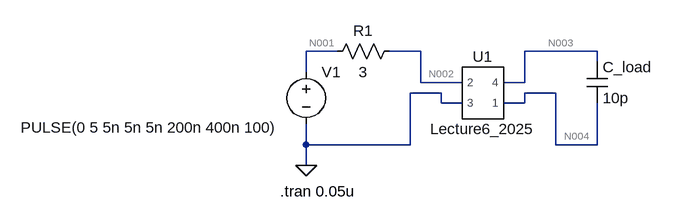
[diagram p0: schematic 08_LTspiceTemplate_SGW2_2024.asc]
08_LTspiceTemplate_SGW2_2024.asc, the LTspice schematic file:
Version 4.1
SHEET 1 880 680
WIRE 0 128 -48 128
WIRE 128 128 80 128
WIRE 400 128 288 128
WIRE 400 144 400 128
WIRE -48 160 -48 128
WIRE 128 176 128 128
WIRE 192 176 128 176
WIRE 288 176 288 128
WIRE 288 176 256 176
WIRE 160 192 112 192
WIRE 336 192 288 192
WIRE 160 208 160 192
WIRE 192 208 160 208
WIRE 288 208 288 192
WIRE 288 208 256 208
WIRE -48 272 -48 240
WIRE 112 272 112 192
WIRE 112 272 -48 272
WIRE 336 272 336 192
WIRE 400 272 400 208
WIRE 400 272 336 272
WIRE -48 304 -48 272
FLAG -48 304 0
SYMBOL voltage -48 144 R0
WINDOW 3 -439 101 Left 2
WINDOW 123 0 0 Left 0
WINDOW 39 0 0 Left 0
SYMATTR Value PULSE(0 5 5n 5n 5n 200n 400n 100)
SYMATTR InstName V1
SYMBOL cap 384 144 R0
SYMATTR InstName C_load
SYMATTR Value 10p
SYMBOL res 96 112 R90
WINDOW 0 0 56 VBottom 2
WINDOW 3 32 56 VTop 2
SYMATTR InstName R1
SYMATTR Value 3
SYMBOL Lecture6_2025 224 192 R0
SYMATTR InstName U1
TEXT -88 344 Left 2 !.tran 0.05u

The netlist it stands for:
* 08_LTspiceTemplate_SGW2_2024.asc
V1 N001 0 PULSE(0 5 5n 5n 5n 200n 400n 100)
C_load N003 N004 10p
R1 N002 N001 3
X§U1 N004 N002 0 N003 Lecture6_2025  ; pins 1 2 3 4
.tran 0.05u
.lib C:\Users\JWar1\Documents\College\Spring_2025\Principles_Of_Electronic_Packaging\Group_Work_1\Lecture6_2025.cir
.backanno
.end

* Results of the author's LTspice run, read from the files saved beside the schematic
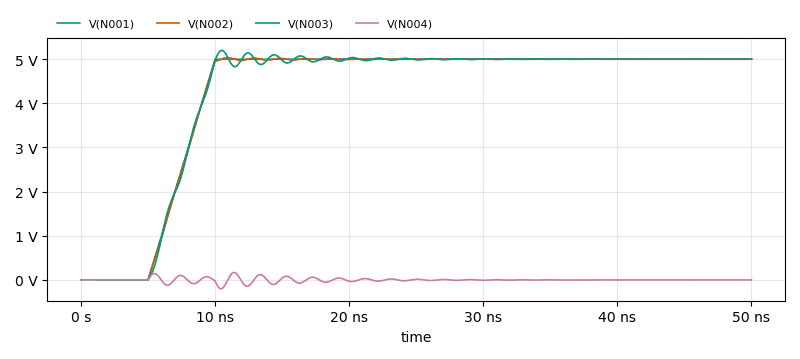
[diagram p1: Transient Analysis of 08_LTspiceTemplate_SGW2_2024.asc, plotted from the saved traces]
* Transient Analysis, 1 run:
*   V(N001): min 0 V, max 5 V, average 4.25 V, rms 4.564 V, last 5 V
*   V(N002): min 0 V, max 5.036 V, average 4.247 V, rms 4.563 V, last 5 V
*   V(N003): min 0 V, max 5.2 V, average 4.247 V, rms 4.564 V, last 5 V
*   V(N004): min -200.4 mV, max 169.1 mV, average 133.2 µV, rms 43.93 mV, last 3.809 µV